# EasyEDA Pro project ProPrj_UNO2FL32x8_COMM_pro_2026-06-11.epro, board ISC_UNO2FL32x8_COMM_1
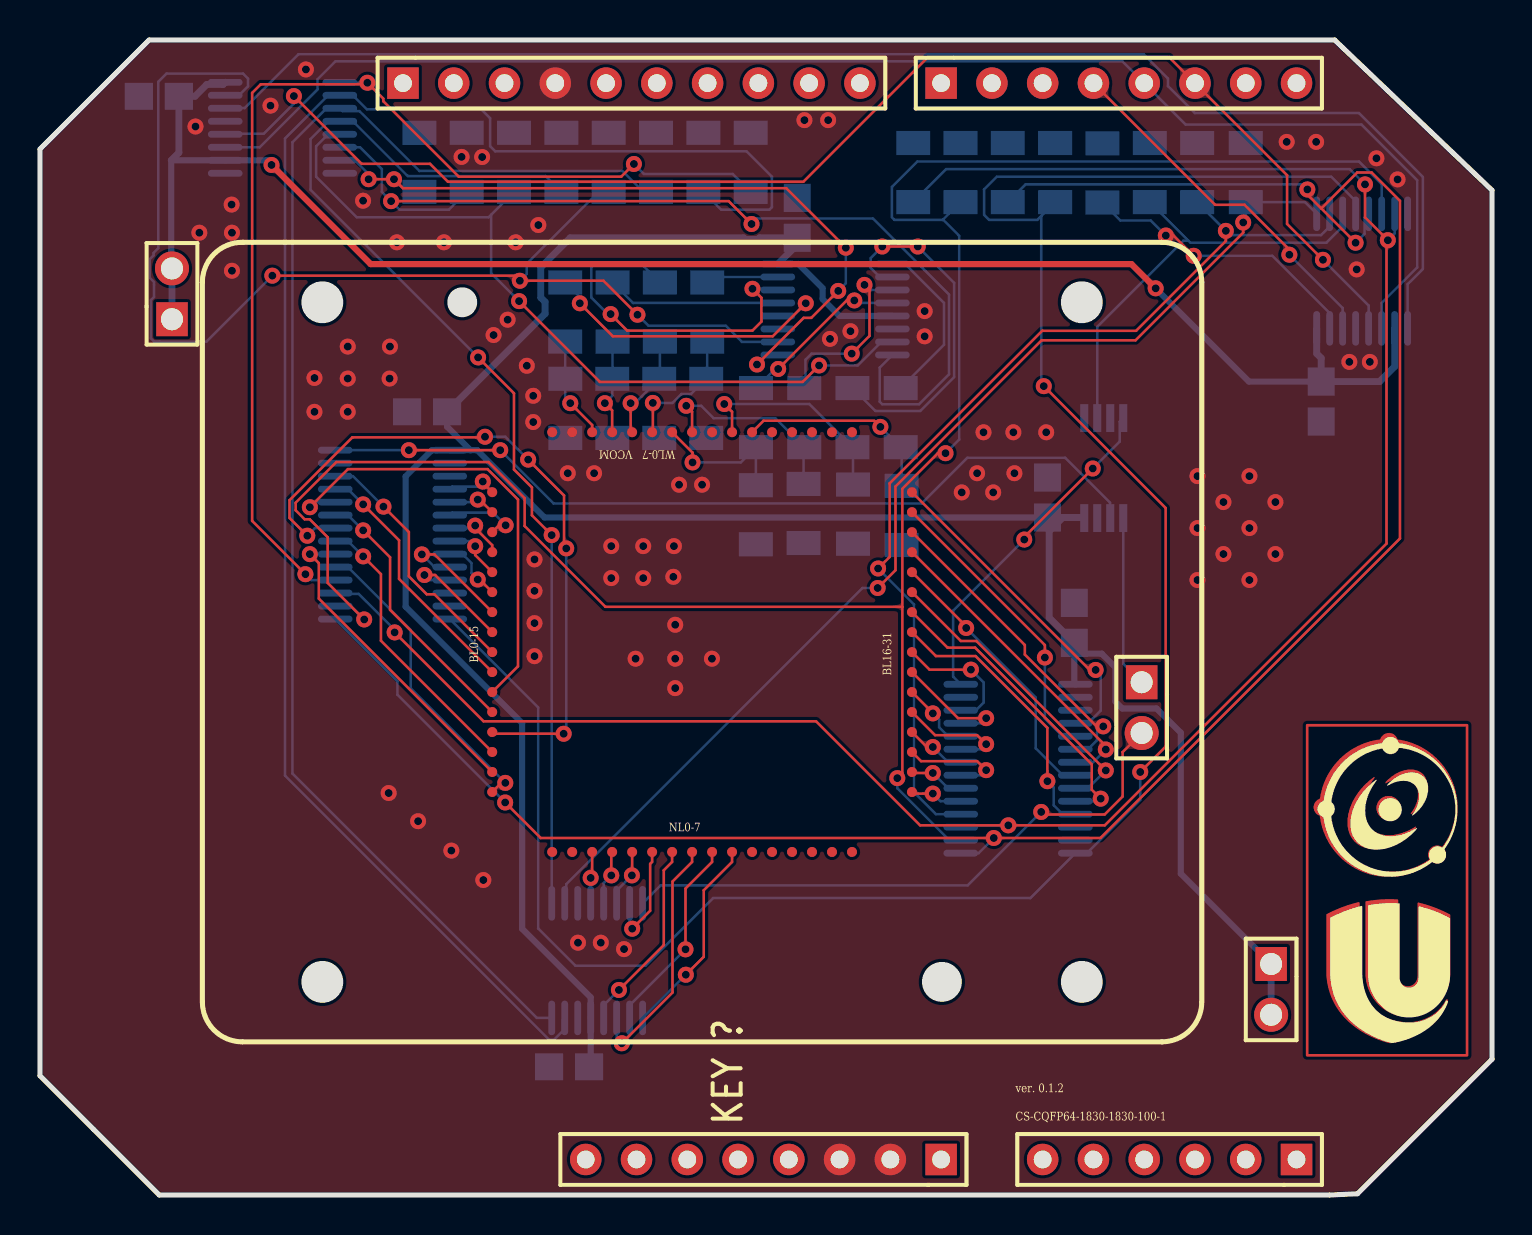
[diagram p4: board, top side]
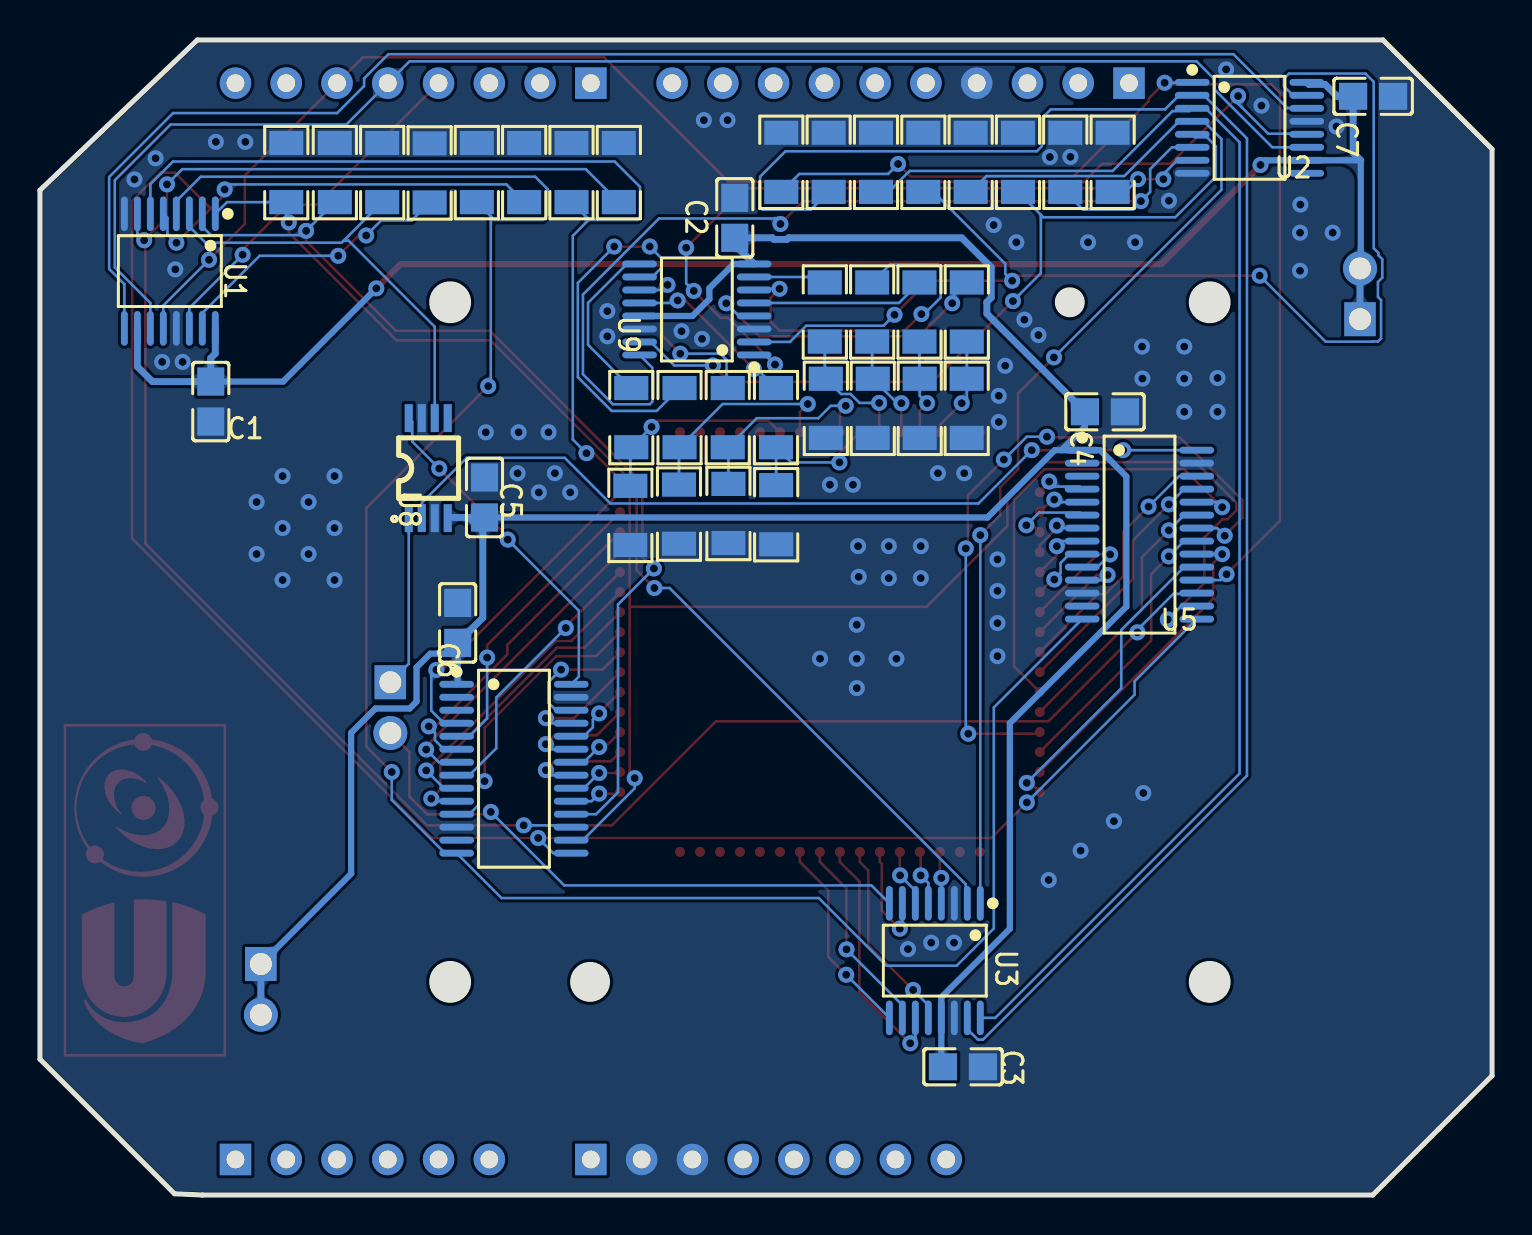
[diagram p5: board, bottom side, seen from below]

Outline 72.65 x 57.78 mm; copper layers: Top Layer, Bottom Layer. Coordinates in mm from the lower left corner of the outline.
Outline path: 0,52.32 0,5.97 5.97,0 64.52,0 65.92,0.06 72.65,6.79 72.65,50.27 64.77,57.78 5.46,57.78 0,52.32
Stack: Top Layer 0.035mm / Dielectric1 1.51mm FR4 er 4.5 / Bottom Layer 0.035mm

## Design rules (mm)
template: User Custom Config
spacing Default (default): track to track 0.127, other pairs 0 to 0.127
spacing PWR: track to track 0.201, other pairs 0 to 0.201
track width Default (default): min 0.127, default 0.127, max 25.4
track width PWR: min 0.305, default 0.305, max 25.4
differential pair differentialPair (default): width min 0.127, default 0.254, max 2.54; gap min 0.152, default 0.152
via Default (default): diameter min 0.8, default 0.8, max 100.025; hole min 0.399, default 0.399, max 59.995
via PWR: diameter min 0.8, default 0.8, max 100.025; hole min 0.399, default 0.399, max 59.995
net GND uses PWR
net VCCA uses PWR
net VCCD uses PWR
net REV uses PWR
net DIR uses PWR
pour e242 uses gge71250
pour e1171 uses gge71250(1)

## Placement (name value [footprint] x y rotation side)
C1  0.1u  [C0805]  64.1 39.69 270 bottom
C2  0.1u  [C0805]  37.89 48.89 90 bottom
C3  0.1u  [C0805]  26.47 6.41 180 bottom
C4  0.1u  [C0805]  19.36 39.18 180 bottom
C5  0.1u  [C0805]  50.41 34.89 90 bottom
C6  0.1u  [C0805]  51.75 28.62 90 bottom
C7  0.1u  [C0805]  5.95 54.97 180 bottom
J1  HDR-M-2.54_1x10  [HDR-M-2.54_1X10]  29.59 55.63 0 top
J2  HDR-M-2.54_1x8  [HDR-M-2.54_1X8]  34.92 1.78 180 top
J3  HDR-M-2.54_1x8  [HDR-M-2.54_1X8]  55.24 55.63 0 top
J4  HDR-M-2.54_1x6  [HDR-M-2.54_1X6]  56.52 1.78 180 top
J5  HDR-M-2.54_1x2  [HDR-M-2.54_1X2]  6.6 45.08 90 top
J6  HDR-M-2.54_1x2  [HDR-M-2.54_1X2]  61.6 10.29 270 top
J7  HDR-M-2.54_1x2  [HDR-M-2.54_1X2]  55.12 24.38 270 top
R1  50k  [R1206]  18.98 51.66 270 bottom
R2  50k  [R1206]  21.35 51.66 270 bottom
R3  50k  [R1206]  23.72 51.66 270 bottom
R4  50k  [R1206]  35.56 51.66 270 bottom
R5  50k  [R1206]  33.19 51.66 270 bottom
R6  50k  [R1206]  30.82 51.66 270 bottom
R7  50k  [R1206]  28.45 51.66 270 bottom
R8  50k  [R1206]  50.79 51.15 270 bottom
R9  50k  [R1206]  48.42 51.15 270 bottom
R10  50k  [R1206]  46.05 51.15 270 bottom
R11  50k  [R1206]  43.68 51.15 270 bottom
R12  50k  [R1206]  55.52 51.15 270 bottom
R13  50k  [R1206]  57.89 51.15 270 bottom
R14  50k  [R1206]  60.33 51.15 270 bottom
R15  50k  [R1206]  53.15 51.13 270 bottom
R16  50k  [R1206]  26.08 51.66 270 bottom
R17  1.8k  [R1206]  26.28 44.17 90 bottom
R18  1.8k  [R1206]  28.64 44.17 90 bottom
R19  1.8k  [R1206]  31.01 44.17 90 bottom
R20  1.8k  [R1206]  33.38 44.17 90 bottom
R21  1.8k  [R1206]  35.82 38.89 90 bottom
R22  1.8k  [R1206]  38.24 38.89 90 bottom
R23  1.8k  [R1206]  40.65 38.89 90 bottom
R24  1.8k  [R1206]  43.06 38.89 90 bottom
R25  3.3k  [R1206]  33.33 39.36 270 bottom
R26  3.3k  [R1206]  30.98 39.36 270 bottom
R27  3.3k  [R1206]  26.28 39.36 270 bottom
R28  3.3k  [R1206]  28.63 39.36 270 bottom
R29  3.3k  [R1206]  38.2 34.1 270 bottom
R30  3.3k  [R1206]  35.82 34.03 270 bottom
R31  3.3k  [R1206]  40.68 34.06 270 bottom
R32  3.3k  [R1206]  43.11 34 270 bottom
U1  74HC595PW,118  [TSSOP-16_L5.0-W4.4-P0.65-LS6.4-BL]  66.15 46.22 0 bottom
U2  74HC595PW,118  [TSSOP-16_L5.0-W4.4-P0.65-LS6.4-BL]  12.13 53.39 270 bottom
U3  ADG708BRUZ-REEL  [TSSOP-16_L5.0-W4.4-P0.65-LS6.4-BL]  27.88 11.73 0 bottom
U5  ADG706BRUZ  [TSSOP-28_L9.7-W4.4-P0.65-LS6.4-BL]  17.64 33.04 270 bottom
U6  ADG706BRUZ  [TSSOP-28_L9.7-W4.4-P0.65-LS6.4-BL]  48.93 21.33 270 bottom
U8  ADG619BRMZ-REEL7  [MSOP-8_L3.0-W3.0-P0.65-LS4.9-TL]  53.22 36.37 90 bottom
U9  ADG708BRUZ-REEL  [TSSOP-16_L5.0-W4.4-P0.65-LS6.4-BL]  39.78 44.3 90 bottom
U10  CS-CQFP64-1830-1830-100-1  [ICS-CQFP64-1830-1830-100-1]  33.13 27.66 90 top

## Footprints (pads in the part's own frame, mm; a bottom-side part is the same pattern mirrored in y, then rotated)
C0805
  rect 1.41x1.35 smd: 1(-1,0) 2(1,0)
HDR-M-2.54_1X2
  rect 1.7x1.575 hole 1.1: 1(-1.27,0)
  round 1.7 hole 1.1: 2(1.27,0)
HDR-M-2.54_1X6
  rect 1.575x1.575 hole 0.889: 1(-6.35,0)
  round 1.575 hole 0.889: 2(-3.81,0) 3(-1.27,0) 4(1.27,0) 5(3.81,0) 6(6.35,0)
HDR-M-2.54_1X8
  rect 1.575x1.575 hole 0.889: 1(-10.16,0)
  round 1.575 hole 0.889: 2(-7.62,0) 3(-5.08,0) 4(-2.54,0) 5(0,0) 6(2.54,0) 7(5.08,0) 8(7.62,0)
HDR-M-2.54_1X10
  rect 1.575x1.575 hole 0.889: 1(-11.43,0)
  round 1.575 hole 0.889: 2(-8.89,0) 3(-6.35,0) 4(-3.81,0) 5(-1.27,0) 6(1.27,0) 7(3.81,0) 8(6.35,0) 9(8.89,0) 10(11.43,0)
ICS-CQFP64-1830-1830-100-1
  round 0.5 smd: 1(-10.5,7.5) 2(-10.5,6.5) 3(-10.5,5.5) 4(-10.5,4.5) 5(-10.5,3.5) 6(-10.5,2.5) 7(-10.5,1.5) 8(-10.5,0.5) 9(-10.5,-0.5) 10(-10.5,-1.5) 11(-10.5,-2.5) 12(-10.5,-3.5) 13(-10.5,-4.5) 14(-10.5,-5.5) 15(-10.5,-6.5) 16(-10.5,-7.5) 17(-7.5,-10.5) 18(-6.5,-10.5) 19(-5.5,-10.5) 20(-4.5,-10.5) 21(-3.5,-10.5) 22(-2.5,-10.5) 23(-1.5,-10.5) 24(-0.5,-10.5) 25(0.5,-10.5) 26(1.5,-10.5) 27(2.5,-10.5) 28(3.5,-10.5) 29(4.5,-10.5) 30(5.5,-10.5) 31(6.5,-10.5) 32(7.5,-10.5) 33(10.5,-7.5) 34(10.5,-6.5) 35(10.5,-5.5) 36(10.5,-4.5) 37(10.5,-3.5) 38(10.5,-2.5) 39(10.5,-1.5) 40(10.5,-0.5) 41(10.5,0.5) 42(10.5,1.5) 43(10.5,2.5) 44(10.5,3.5) 45(10.5,4.5) 46(10.5,5.5) 47(10.5,6.5) 48(10.5,7.5) 49(7.5,10.5) 50(6.5,10.5) 51(5.5,10.5) 52(4.5,10.5) 53(3.5,10.5) 54(2.5,10.5) 55(1.5,10.5) 56(0.5,10.5) 57(-0.5,10.5) 58(-1.5,10.5) 59(-2.5,10.5) 60(-3.5,10.5) 61(-4.5,10.5) 62(-5.5,10.5) 63(-6.5,10.5) 64(-7.5,10.5)
MSOP-8_L3.0-W3.0-P0.65-LS4.9-TL
  rect 1.397x0.406 smd: 1(-2.502,0.975) 2(-2.502,0.325) 3(-2.502,-0.325) 4(-2.502,-0.975) 5(2.502,-0.975) 6(2.502,-0.325) 7(2.502,0.325) 8(2.502,0.975)
R1206
  rect 1.208x1.701 smd: 1(-1.479,0) 2(1.479,0)
TSSOP-16_L5.0-W4.4-P0.65-LS6.4-BL
  oval 0.343x1.732 smd: 1(-2.275,-2.866) 2(-1.625,-2.866) 3(-0.975,-2.866) 4(-0.325,-2.866) 5(0.325,-2.866) 6(0.975,-2.866) 7(1.625,-2.866) 8(2.275,-2.866) 9(2.275,2.865) 10(1.625,2.865) 11(0.975,2.865) 12(0.325,2.865) 13(-0.325,2.865) 14(-0.975,2.865) 15(-1.625,2.865) 16(-2.275,2.865)
TSSOP-28_L9.7-W4.4-P0.65-LS6.4-BL
  oval 0.343x1.732 smd: 1(-4.225,-2.866) 2(-3.575,-2.866) 3(-2.925,-2.866) 4(-2.275,-2.866) 5(-1.625,-2.866) 6(-0.975,-2.866) 7(-0.325,-2.866) 8(0.325,-2.866) 9(0.975,-2.866) 10(1.625,-2.866) 11(2.275,-2.866) 12(2.925,-2.866) 13(3.575,-2.866) 14(4.225,-2.866) 15(4.225,2.865) 16(3.575,2.865) 17(2.925,2.865) 18(2.275,2.865) 19(1.625,2.865) 20(0.975,2.865) 21(0.325,2.865) 22(-0.325,2.865) 23(-0.975,2.865) 24(-1.625,2.865) 25(-2.275,2.865) 26(-2.925,2.865) 27(-3.575,2.865) 28(-4.225,2.865)

## Nets
As in the schematic.

Pads without a net: J4 1 2 3 4 5 6; U2 9; U5 2 3 13; U6 2 3 13; U8 5; U10 1 2 11 12 13 14 15 16 33 34 35 36 37 40 48

## Via types
v1: diameter 0.8, hole 0.399, Top Layer to Bottom Layer, 177 vias
v2: diameter 0.8, hole 0.4, Top Layer to Bottom Layer, 13 vias

## Routing (per net, layer and track width the routed paths; a pad name or vN(x,y) marks a point on that pad's centre or on a via; arc(x,y) is an arc through that point)
GND:
  vias: v1(7.78,53.45) v1(7.97,48.14) v1(9.59,49.55) v1(9.61,48.14) v1(9.61,46.24) v1(11.53,54.5) v1(13.3,56.31) v1(13.73,40.88) v1(13.73,39.18) v1(16.17,49.74) v1(17.45,20.11) v1(18.92,18.7) v1(20.58,17.23) v1(21.09,51.94) v1(22.12,51.93) v1(22.18,15.76) v1(22.69,43.02) v1(23.4,43.79) v1(24.36,41.49) v1(24.68,39.98) v1(24.68,38.67) v1(24.74,31.8) v1(24.74,30.22) v1(24.74,28.61) v1(24.74,26.96) v1(24.93,48.53) v1(26.41,36.11) v1(26.92,12.62) v1(27.72,36.11) v1(28.06,12.62) v1(28.58,32.46) v1(28.58,30.86) v1(29.22,12.3) v1(30.18,32.46) v1(30.18,30.86) v1(31.72,32.46) v1(31.69,30.93) v1(31.97,35.53) v1(33.13,35.53) v1(38.24,53.78) v1(39.43,53.78) v1(39.52,42.83) v1(40.55,43.22) v1(44.26,44.22) v1(44.26,42.96) v1(46.12,35.15) v1(46.89,36.11) v1(47.2,38.16) v1(47.69,35.15) v1(48.7,38.16) v1(48.75,36.11) v1(50.34,38.16) v1(57.91,35.97) v1(57.91,33.37) v1(57.91,30.77) v1(59.21,34.67) v1(59.21,32.07) v1(60.51,35.97) v1(60.51,33.37) v1(60.51,30.77) v1(61.81,34.67) v1(61.81,32.07) v1(62.37,52.69) v1(63.85,52.69) v1(65.51,41.68) v1(65.88,46.31) v1(66.53,41.68) v1(66.86,51.86) v1(67.92,50.81) v2(15.4,42.45) v2(15.4,40.85) v2(15.4,39.18) v2(17.51,42.45) v2(17.49,40.85) v2(17.86,47.66) v2(20.21,47.66) v2(23.8,47.66) v2(29.8,26.83) v2(31.78,28.53) v2(31.78,26.83) v2(31.78,25.36) v2(33.62,26.83)
VCCA: length 135.4
  Bottom Layer w0.305: 21.87,37.27 21.87,37.26 ; 21.54,37.26 20.36,38.44 C4.1
  Bottom Layer w0.308: U5.1 21.87,37.26 ; U9.8 37.94,46.58 39.16,45.37 39.16,44.82 40,43.98 U9.13 ; U6.1 51.75,25.6 51.75,27.08 53.12,27.08 53.81,26.4 53.81,24.68 54.15,24.34 55.86,24.34 57.08,23.13 57.08,16.08 J6.1 ; C5.1 25.24,33.89 21.87,37.26 ; C3.1 27.55,6.5 U3.13 27.55,9.89 24.12,13.32 24.12,23.61 18.29,29.44 18.29,35.95 19.61,37.26 19.87,37.26
  Bottom Layer w0.343: C6.1 50.49,28.88 50.49,33.21 51.18,33.89 ; C5.1 51.18,33.89 ; 51.18,33.89 52.22,33.89 U8.4 ; U9.8 37.89,47.55 C2.1 36,47.89 35.92,47.81 35.28,47.81 35.2,47.89 26.53,47.89 25.05,46.41 25.05,44.9 25.27,44.68 25.27,44.09 C4.1 ; J6.1 J6.2
VCCD: length 84.7
  Top Layer w0.308: v1(55.82,45.36) 54.61,46.57 16.54,46.57 v1(11.58,51.53)
  Bottom Layer w0.308: C1.1 60.48,40.69 v1(55.82,45.36) ; v1(11.58,51.53) 11.35,51.77 U2.10 6.57,51.77 6.57,46.39 J5.2
  Bottom Layer w0.343: 6.57,51.77 6.95,52.15 C7.1 7.75,54.97 8.35,55.56 9.16,55.56 U2.16 ; U1.10 67.77,41.45 67.02,40.69 C1.1 64.1,41.87 63.87,42.1 U1.16 ; J5.2 J5.1
B_0: length 15.5
  Top Layer w0.127: v1(23.28,20.62) 23.08,20.62 U10.64
  Bottom Layer w0.127: v1(23.28,20.62) 18.55,25.35 18.55,28.27 15.41,31.41 14.77,31.41
B_1: length 15.9
  Top Layer w0.127: U10.63 13.95,29.84 13.95,31.61 v1(13.5,32.06)
  Bottom Layer w0.127: 14.77,32.06 v1(13.5,32.06)
B_2: length 14.2
  Top Layer w0.127: U10.62 17.06,27.73 17.06,31.06 v1(16.17,31.95)
  Bottom Layer w0.127: 14.77,32.71 15.41,32.71 v1(16.17,31.95)
B_3: length 35.6
  Top Layer w0.127: v1(26.2,23.08) 22.71,23.08 U10.61 ; v1(26.33,32.35) 26.22,32.46 26.22,35 v1(24.42,36.79) ; v1(13.37,32.98) 12.49,33.87 12.49,34.76 15.63,37.9 22.23,37.9 v1(22.26,37.94)
  Bottom Layer w0.127: v1(13.37,32.98) 13.76,33.36 U5.22 ; v1(24.42,36.79) 23.28,37.94 v1(22.26,37.94) ; v1(26.2,23.08) 26.33,23.2 v1(26.33,32.35)
B_4: length 13.5
  Top Layer w0.127: v1(16.17,33.25) 17.52,31.91 17.52,29.27 U10.60
  Bottom Layer w0.127: v1(16.17,33.25) 15.41,34.01 U5.23
B_5: length 23.4
  Top Layer w0.127: v1(13.5,34.41) 15.41,36.31 22.39,36.31 23.92,34.79 23.92,26.45 U10.59
  Bottom Layer w0.127: v1(13.5,34.41) 13.76,34.66 U5.24
B_6: length 12.8
  Top Layer w0.127: U10.58 17.96,30.82 17.96,32.76 v1(16.17,34.55)
  Bottom Layer w0.127: U5.25 15.41,35.31 v1(16.17,34.55)
B_7: length 12.8
  Top Layer w0.127: v1(17.18,34.44) 18.45,33.17 18.45,30.95 19.35,30.05 19.73,30.05 U10.57
  Bottom Layer w0.127: U5.26 15.66,35.96 v1(17.18,34.44)
B_8: length 5.9
  Top Layer w0.127: U10.56 19.77,31.02 v1(19.23,31.02)
  Bottom Layer w0.127: v1(19.23,31.02) 19.49,30.76 U5.11
B_9: length 6.4
  Top Layer w0.127: v1(19.11,32.05) 19.74,32.05 U10.55
  Bottom Layer w0.127: v1(19.11,32.05) 19.74,31.41 20.5,31.41
B_10: length 3.2
  Top Layer w0.127: U10.54 21.99,30.79 v1(21.9,30.79)
  Bottom Layer w0.127: 20.5,32.06 21.14,32.06 21.59,31.61 21.59,31.11 v1(21.9,30.79)
B_11: length 3
  Top Layer w0.127: U10.53 21.77,32.02 v1(21.77,32.46)
  Bottom Layer w0.127: v1(21.77,32.46) 21.52,32.71 20.5,32.71
B_12: length 3
  Top Layer w0.127: v1(21.77,33.49) 21.77,33.36 22.63,32.51 U10.52
  Bottom Layer w0.127: U5.7 21.65,33.36 v1(21.77,33.49)
B_13: length 3.9
  Top Layer w0.127: v1(23.3,33.51) 22.97,33.51 U10.51
  Bottom Layer w0.127: U5.6 20.63,34.14 22.66,34.14 v1(23.3,33.51)
B_14: length 2.4
  Top Layer w0.127: v1(21.9,34.79) 22,34.79 U10.50
  Bottom Layer w0.127: v1(21.9,34.79) 21.77,34.66 U5.5
B_15: length 2.5
  Top Layer w0.127: v1(22.15,35.69) 22.15,35.63 U10.49
  Bottom Layer w0.127: U5.4 20.63,35.44 21.9,35.44 v1(22.15,35.69)
B_16: length 2.6
  Top Layer w0.127: v1(44.67,20.08) 43.7,20.08 U10.17
  Bottom Layer w0.127: U6.19 45.05,19.7 v1(44.67,20.08)
B_17: length 2.8
  Top Layer w0.127: U10.18 43.67,21.11 v1(44.67,21.11)
  Bottom Layer w0.127: v1(44.67,21.11) 45.43,20.35 U6.20
B_18: length 5.5
  Top Layer w0.127: v1(47.34,21.26) 46.89,21.7 44.08,21.7 U10.19
  Bottom Layer w0.127: 46.07,21 47.08,21 v1(47.34,21.26)
B_19: length 3.1
  Top Layer w0.127: U10.20 44.37,22.41 v1(44.67,22.41)
  Bottom Layer w0.127: U6.22 45.43,21.65 v1(44.67,22.41)
B_20: length 5.8
  Top Layer w0.127: v1(47.34,22.56) 46.89,23 44.78,23 U10.21
  Bottom Layer w0.127: U6.23 47.08,22.3 v1(47.34,22.56)
B_21: length 3.6
  Top Layer w0.127: U10.22 44.67,24.12 v1(44.67,24.09)
  Bottom Layer w0.127: U6.24 45.43,22.95 44.98,23.4 44.98,23.78 v1(44.67,24.09)
B_22: length 6
  Top Layer w0.127: U10.23 45.93,23.86 v1(47.34,23.86)
  Bottom Layer w0.127: v1(47.34,23.86) 47.08,23.6 U6.25
B_23: length 6.5
  Top Layer w0.127: U10.24 44.5,26.28 v1(46.58,26.28)
  Bottom Layer w0.127: v1(46.58,26.28) 47.21,25.65 47.21,24.63 46.83,24.25 U6.26
B_24: length 14
  Top Layer w0.127: v1(50.4,20.7) 50.4,23.37 46.81,26.96 44.83,26.96 U10.25
  Bottom Layer w0.127: U6.11 51.16,19.05 50.71,19.5 50.71,20.39 v1(50.4,20.7)
B_25: length 15.4
  Top Layer w0.127: U10.26 45.4,27.39 46.78,27.39 52.62,21.55 52.62,20.28 v1(53.07,19.83)
  Bottom Layer w0.127: v1(53.07,19.83) 52.94,19.7 U6.10
B_26: length 15.3
  Top Layer w0.127: v1(53.32,21.24) 46.85,27.72 46.07,27.72 U10.27
  Bottom Layer w0.127: v1(53.32,21.24) 52.43,20.35 U6.9
B_27: length 13.9
  Top Layer w0.127: U10.28 46.34,28.45 v1(46.34,28.37)
  Bottom Layer w0.127: v1(46.34,28.37) 49.82,24.89 49.82,22.35 51.16,21 51.8,21
B_28: length 15.7
  Top Layer w0.127: v1(53.32,22.29) 53.32,22.47 U10.29
  Bottom Layer w0.127: v1(53.32,22.29) 52.69,21.65 U6.7
B_29: length 16
  Top Layer w0.127: v1(53.2,23.44) 52.86,23.44 49.27,27.04 49.27,27.52 U10.30
  Bottom Layer w0.127: U6.6 52.43,22.3 52.88,22.75 52.88,23.13 v1(53.2,23.44)
B_30: length 15
  Top Layer w0.127: U10.31 50.27,27.51 v1(50.27,26.89)
  Bottom Layer w0.127: v1(50.27,26.89) 50.27,23.84 51.16,22.95 U6.5
B_31: length 16.5
  Top Layer w0.127: U10.32 52.52,26.27 v1(52.82,26.27)
  Bottom Layer w0.127: U6.4 52.43,23.6 53.07,24.24 53.07,26.02 v1(52.82,26.27)
DIR: length 8.6
  Bottom Layer w0.127: J7.1 54.2,26.58 54.2,33.86
DIR_MUX_1: length 42.5
  Top Layer w0.127: v1(18.45,37.26) v1(23.03,37.26)
  Bottom Layer w0.127: v1(23.03,37.26) 25.69,34.6 44.11,34.6 46.39,36.88 51.29,36.88 53.54,34.64 53.54,33.88 U8.2 ; U5.28 v1(18.45,37.26)
DIR_MUX_2: length 17
  Top Layer w0.127: v1(49.24,32.79) 49.24,32.92 v1(52.67,36.35)
  Bottom Layer w0.127: v1(49.24,32.79) 45.69,29.23 45.69,25.93 U6.28 ; 54.2,38.87 54.02,38.69 54.02,37.69 v1(52.67,36.35)
IN_MUX_0: length 109.3
  Top Layer w0.127: 67.37,47.83 67.37,32.59 53.27,18.5 v1(48.45,18.5) 44.03,18.5 38.83,23.7 22.19,23.7 v1(17.74,28.15) ; 67.37,47.83 66.29,48.91 v1(66.29,50.56) ; 67.37,47.83 v1(67.43,47.77)
  Bottom Layer w0.127: U5.17 14.9,30.11 14.94,30.07 15.95,30.07 17.74,28.28 v1(17.74,28.15) ; v1(67.43,47.77) 67.77,48.11 U1.7 ; v1(66.29,50.56) 65.53,51.32 45.34,51.32 R11.2 ; v1(48.45,18.5) 46.16,18.5 U6.17
IN_MUX_1: length 111
  Top Layer w0.127: v1(16.22,28.79) 14.39,30.62 14.39,32.91 13.5,33.81 13.24,33.81 12.79,34.25 12.79,34.64 14.82,36.67 22.44,36.67 24.24,34.87 24.24,33.47 28.29,29.43 43.15,29.43 ; 43.15,29.43 43.15,21.11 v1(42.89,20.86) ; 43.15,29.43 43.15,35.33 44.92,37.11 v1(45.3,37.11)
  Bottom Layer w0.127: U5.16 15.55,29.46 v1(16.22,28.79) ; R10.2 45.18,48.8 ; 45.18,48.8 45.99,47.98 45.99,37.8 v1(45.3,37.11) ; 45.18,48.8 45.16,48.78 42.75,48.78 42.62,48.91 42.62,50.43 43.89,51.7 65.99,51.7 67.12,50.57 U1.6 ; U6.16 45.49,17.75 42.89,20.35 v1(42.89,20.86)
IN_MUX_2: length 109.4
  Top Layer w0.127: v1(63.41,50.31) 63.41,50.05 64.1,49.36 ; 64.1,49.36 65.9,51.15 66.63,51.15 68.04,49.74 68.04,32.85 53.05,17.86 v1(47.72,17.86) 25.05,17.86 v1(23.27,19.64) ; 64.1,49.36 v1(65.82,47.64)
  Bottom Layer w0.127: v1(63.41,50.31) 63.15,50.56 49.31,50.56 R9.2 ; U1.5 66.27,48.88 66.27,48.09 v1(65.82,47.64) ; v1(47.72,17.86) 46.96,17.1 U6.15 ; v1(23.27,19.64) 17.88,25.03 17.88,25.7 U5.15
IN_MUX_3: length 109.2
  Top Layer w0.127: v1(50.22,40.47) 56.32,34.37 56.32,22.43 v1(55.05,21.16)
  Bottom Layer w0.127: v1(50.22,40.47) 50.09,40.59 50.09,48.98 ; 50.09,48.98 49.9,48.78 47.49,48.78 47.23,49.04 47.23,50.31 47.87,50.94 64.61,50.94 65.82,49.72 U1.4 ; 50.09,48.98 R8.2 ; U5.14 24.92,24.39 24.92,13.33 26.79,11.47 30.29,11.47 33.68,14.86 49.55,14.86 U6.14 52.38,17.1 55.05,19.77 v1(55.05,21.16)
IN_MUX_EN_1: length 56.2
  Top Layer w0.127: v1(29.71,51.58) 29.08,50.95 20.95,50.95 17.17,54.72 17.17,54.85 16.46,55.57 ; v1(13.28,31.06) 10.61,33.73 10.61,55.14 11.05,55.57 16.46,55.57 ; 16.46,55.57 v1(16.38,55.64)
  Bottom Layer w0.127: v1(29.71,51.58) 30.21,51.08 34.66,51.08 R4.2 ; U2.1 15.02,55.64 v1(16.38,55.64) ; U5.18 13.58,30.76 v1(13.28,31.06)
IN_MUX_EN_2: length 49.7
  Top Layer w0.127: v1(41.93,31.34) 42.51,31.92 42.51,35.6 50.14,43.24 54.84,43.24 59.33,47.73 v1(59.33,48.24)
  Bottom Layer w0.127: U6.18 44.83,19.05 43.73,20.15 43.73,29.55 v1(41.93,31.34) ; U1.2 64.52,48.45 64.09,48.02 59.54,48.02 R13.2
OUT_MUX_0: length 57.6
  Top Layer w0.127: v1(21.92,41.91) 23.71,40.11 23.71,36.3 24.61,35.4 24.61,34 v1(25.6,33.02)
  Bottom Layer w0.127: v1(21.92,41.91) 13.54,50.29 13.54,52.83 14.43,53.72 15.66,53.72 18.4,50.98 25.29,50.98 R16.2 ; v1(25.6,33.02) U3.1
OUT_MUX_1: length 70.3
  Bottom Layer w0.127: 15.04,54.32 15.14,54.22 15.98,54.22 18.98,51.23 29.14,51.23 30.19,50.18 R6.2 ; 15.04,54.32 U2.3 ; 15.04,54.32 14.28,54.32 12.63,52.67 12.63,21.08 24.85,8.86 U3.16
OUT_MUX_2: length 85.2
  Bottom Layer w0.127: R5.2 34.08,49.3 36.49,49.3 36.62,49.42 36.62,50.95 35.35,52.22 22.77,52.22 22.52,52.47 22.52,53.87 22.07,54.32 16.36,54.32 15.66,55.02 U2.2 14.42,55.02 12.26,52.86 12.26,20.98 25.47,7.77 25.72,7.77 26.17,8.22 26.17,8.78 U3.15
OUT_MUX_EN: length 56.2
  Top Layer w0.127: v1(41.91,30.37) 42.8,31.26 42.8,35.45 50.11,42.76 54.81,42.76 60.2,48.15 v1(60.2,48.66)
  Bottom Layer w0.127: U3.2 26.33,14.67 26.33,15.55 41.15,30.37 v1(41.91,30.37) ; v1(60.2,48.66) 60.33,48.78 R14.2 63.29,49.67 U1.1
REG_D: length 18.3
  Top Layer w0.127: v1(62.51,47.04) 62.51,47.29 60.26,49.54 58.79,49.54 J3.4
  Bottom Layer w0.127: v1(62.51,47.04) 65.17,44.37 65.17,43.36
REG_LC: length 70.3
  Top Layer w0.127: v1(64.19,46.79) 62.39,48.58 62.39,51.02 J3.6 56.49,56.92 44.42,56.92 38.19,50.69 20.41,50.69 19.51,51.59 16.09,51.59 v1(12.7,54.98)
  Bottom Layer w0.127: v1(64.19,46.79) 66.47,44.5 U1.12 ; U2.12 9.3,53.1 11.2,53.1 12.7,54.6 v1(12.7,54.98)
REG_SC: length 72.3
  Bottom Layer w0.127: 9.27,52.42 10.99,52.42 13.89,55.31 13.89,55.82 14.78,56.72 54.15,56.72 J3.5 57.32,53.55 66.11,53.55 68.9,50.77 68.9,46.41 67.12,44.63 U1.11
REV: length 29.9
  Top Layer w0.127: v1(50.09,19.16) 50.22,19.04 53.27,19.04 54.16,19.94 54.16,22.16 J7.2
  Bottom Layer w0.127: v1(50.09,19.16) 46.42,15.49 31.05,15.49 U3.8
SPDT: length 22.4
  Bottom Layer w0.127: R12.2 57.46,47.74 ; 57.46,47.74 57.2,47.74 52.9,43.44 U8.6 ; 57.46,47.74 57.56,47.64 64.36,47.64 65.17,48.45 65.17,49.09
WL_MUX_0: length 38
  Top Layer w0.127: v1(39.94,45.23) 38.59,43.88 38.21,43.88 v1(35.87,41.55) ; v1(16.44,50.82) v1(17.71,50.82) 18.16,50.37 37.34,50.37 v1(40.32,47.39)
  Bottom Layer w0.127: v1(35.87,41.55) 36.32,42 36.88,42 U9.1 ; v1(16.44,50.82) 16.44,51.07 15.75,51.77 U2.7 ; v1(39.94,45.23) 40.32,45.61 v1(40.32,47.39) ; v1(17.71,50.82) 18.35,50.18 R1.2
WL_MUX_1: length 49.5
  Top Layer w0.127: v1(35.6,48.58) 34.46,49.72 v1(17.57,49.72)
  Bottom Layer w0.127: R2.2 20.46,49.3 17.99,49.3 v1(17.57,49.72) 17.1,50.18 17.1,51.33 16.02,52.42 15,52.42 ; v1(35.6,48.58) 35.88,48.86 41.67,48.86 45.48,45.05 45.48,41.06 43.98,39.56 42.14,39.56 42.01,39.69 42.01,41.39 U9.16
WL_MUX_2: length 40.3
  Top Layer w0.127: v1(38.98,41.5) 38.16,40.68 28.01,40.68 v1(23.97,44.72)
  Bottom Layer w0.127: v1(38.98,41.5) 40.91,41.5 42.09,42.68 U9.15 ; 22.57,49.04 22.57,46.12 v1(23.97,44.72) ; 22.57,49.04 22.45,48.91 15.85,48.91 13.82,50.95 13.82,52.47 14.27,52.92 14.85,52.92 U2.5 ; 22.57,49.04 R3.2
WL_MUX_EN: length 60.5
  Top Layer w0.127: 24.07,45.74 23.82,45.99 v1(11.63,45.99) ; 24.07,45.74 v1(24.01,45.74) ; 24.07,45.74 28.19,45.74 v1(29.89,44.04)
  Bottom Layer w0.127: R7.2 27.95,50.18 24.35,46.59 24.35,46.08 v1(24.01,45.74) ; 5.71,45.55 5.71,44.93 5.55,44.77 5.55,42.86 5.71,42.7 5.98,42.7 5.99,42.69 8.32,42.69 v1(11.63,45.99) ; U2.15 9.96,55.02 10.41,55.47 10.41,55.85 10.16,56.1 6.33,56.1 5.92,55.69 5.92,47.37 5.68,47.13 5.68,47.01 5.49,46.82 5.49,45.89 5.71,45.68 5.71,45.55 ; U9.2 35.12,42.68 34.31,43.49 30.44,43.49 v1(29.89,44.04)
$1N32: length 71.7
  Bottom Layer w0.127: U1.9 68.42,45.57 69.19,46.33 69.19,50.93 65.99,54.13 57.78,54.13 56.43,55.48 56.43,55.86 55.22,57.07 12.94,57.07 10.24,54.38 9.28,54.38 U2.14
$1N59: length 2.6
  Top Layer w0.127: U10.3 27.63,15.94 v1(27.55,15.86)
  Bottom Layer w0.127: U3.4 v1(27.55,15.86)
$1N60: length 2.7
  Top Layer w0.127: v1(28.58,15.99) 28.58,17.12 U10.4
  Bottom Layer w0.127: v1(28.58,15.99) 28.2,15.61 U3.5
$1N61: length 2.9
  Top Layer w0.127: U10.5 29.63,16 v1(29.61,15.99)
  Bottom Layer w0.127: v1(29.61,15.99) 28.85,15.23 U3.6
$1N62: length 5.6
  Top Layer w0.127: v1(29.63,13.32) 30.53,14.22 30.53,16.56 30.63,16.66 U10.6
  Bottom Layer w0.127: v1(29.63,13.32) 29.5,13.45 U3.7
$1N63: length 9.7
  Top Layer w0.127: U10.7 31.63,16.66 31.21,16.25 31.21,12.5 v1(28.96,10.26)
  Bottom Layer w0.127: U3.12 28.2,9.5 v1(28.96,10.26)
$1N64: length 12.4
  Top Layer w0.127: U10.8 32.63,16.66 31.65,15.68 31.65,10.13 v1(29.11,7.59)
  Bottom Layer w0.127: v1(29.11,7.59) 28.85,7.85 U3.11
$1N65: length 10
  Top Layer w0.127: U10.9 33.63,16.66 32.3,15.33 v1(32.3,12.29)
  Bottom Layer w0.127: v1(32.3,12.29) 29.5,9.5 U3.10
$1N66: length 10.2
  Top Layer w0.127: U10.10 34.63,16.66 33.21,15.25 33.21,11.92 v1(32.31,11.02)
  Bottom Layer w0.127: U3.9 v1(32.31,11.02)
$1N84: length 14.4
  Top Layer w0.127: v1(57.72,46.99) 56.71,48 v1(56.33,48)
  Bottom Layer w0.127: v1(57.72,46.99) 61.66,46.99 64.52,44.12 U1.15 ; v1(56.33,48) 55.57,48.76 54.05,48.76 R15.2
$1N86: length 15.7
  Top Layer w0.127: v1(38.31,44.61) 36.66,42.96 28.66,42.96 v1(27.01,44.61)
  Bottom Layer w0.127: v1(27.01,44.61) 27.01,44.92 26.28,45.65 ; U9.4 37.68,43.98 v1(38.31,44.61)
$1N87: length 5.1
  Top Layer w0.127: v1(26.53,39.62) 27.63,38.52 U10.46
  Bottom Layer w0.127: R17.1 26.28,39.87 v1(26.53,39.62)
$1N88: length 8.7
  Bottom Layer w0.127: 28.64,45.65 29.67,44.63 U9.5
$1N89: length 4.8
  Top Layer w0.127: v1(28.26,39.62) 28.63,39.25 U10.45
  Bottom Layer w0.127: v1(28.26,39.62) 28.63,39.99 R28.1 28.64,40.85 R18.1
$1N90: length 17.9
  Top Layer w0.127: v1(35.64,45.34) 36.09,44.89 36.09,43.69 35.64,43.25 29.38,43.25 v1(28.55,44.07)
  Bottom Layer w0.127: U9.6 36.86,45.34 v1(35.64,45.34) ; v1(28.55,44.07) 28.41,44.07 27.58,44.9 27.58,46.42 27.71,46.54 30.12,46.54 31.01,45.65
$1N91: length 5.3
  Top Layer w0.127: v1(29.55,39.61) 29.55,38.24 U10.44
  Bottom Layer w0.127: v1(29.55,39.61) 29.76,39.61 R26.1 31.01,40.87 R19.1
$1N92: length 3.6
  Bottom Layer w0.127: U9.7 33.66,45.93 33.38,45.65
$1N93: length 6.5
  Top Layer w0.127: U10.43 30.66,38.2 v1(30.66,39.63)
  Bottom Layer w0.127: v1(30.66,39.63) 31.64,39.63 32.09,40.07 32.57,40.07 R25.1 33.38,40.89 R20.1
$1N94: length 7.3
  Top Layer w0.127: U10.42 32.65,37.14 v1(32.65,36.65)
  Bottom Layer w0.127: v1(32.65,36.65) 35.06,36.65 35.82,37.41 ; 35.82,37.41 35.82,35.51 ; 35.82,37.41 R21.1
$1N95: length 8.7
  Top Layer w0.127: v1(36.93,41.33) 40.36,44.75 v1(40.74,44.75)
  Bottom Layer w0.127: v1(40.74,44.75) 40.87,44.63 U9.12 ; R21.2 36.78,41.33 v1(36.93,41.33)
$1N96: length 9.3
  Top Layer w0.127: v1(40.61,42.09) 41.5,42.98 41.5,45.28 v1(41.25,45.53)
  Bottom Layer w0.127: R22.2 38.3,40.43 38.3,41.78 38.61,42.09 v1(40.61,42.09) ; v1(41.25,45.53) 41.5,45.28 U9.11
$1N97: length 10.1
  Top Layer w0.127: U10.41 32.63,39.19 v1(32.33,39.48)
  Bottom Layer w0.127: 38.2,35.58 38.2,37.38 R22.1 36.79,38.86 33.7,38.86 33.08,39.48 v1(32.33,39.48)
$1N98: length 17.9
  Top Layer w0.127: v1(42.14,47.45) v1(43.92,47.45)
  Bottom Layer w0.127: v1(43.92,47.45) 45.73,45.63 45.73,40.92 44.04,39.23 41.79,39.23 R23.2 ; v1(42.14,47.45) 41.56,46.88 41.56,46.38 42.01,45.93 U9.10
$1N99: length 10.8
  Top Layer w0.127: v1(34.23,39.57) 34.63,39.18 U10.39
  Bottom Layer w0.127: v1(34.23,39.57) 38.49,39.57 R23.1 40.68,37.39 40.68,35.54
$1N100: length 10.2
  Top Layer w0.127: U10.38 36.2,38.73 41.74,38.73 v1(42.05,38.43)
  Bottom Layer w0.127: v1(42.05,38.43) R24.1 43.11,37.37 43.11,35.48
$1N101: length 8.5
  Bottom Layer w0.127: U9.9 43.28,46.58 45.23,44.63 45.23,42.54 R24.2

## Copper pours and planes (outline as drawn; the poured copper is in the pictures)
GND on Top Layer: -6.62,63.76 -6.62,-3.7 -2.46,-7.86 80.8,-7.86 83.75,-4.91 83.75,63.44 82.02,65.17
GND on Bottom Layer: -10.14,63.25 -10.14,-4.21 -5.98,-8.37 77.29,-8.37 80.23,-5.43 80.23,62.93 78.5,64.66

Small or netless copper shapes (teardrops, artwork), in the pictures only: 172 on Top Layer, 301 on Bottom Layer

## Text on the board
Top Silkscreen Layer: KEY 🔴 | ver. 0.1.2 / CS-CQFP64-1830-1830-100-1 | BL0-15 | WL0-7   VCOM | NL0-7 | BL16-31
